# EasyEDA Pro project 单相逆变离并网和整流拓扑.eprj, schematic Schematic2
Board Name: 后级LCL滤波; Create Date: 2026-03-23; Page Name: P1; Project Name: 单相逆变离并网; Schematic Name: Schematic2; Update Date: 2026-03-25; Company: 嘉立创EDA; Page Size: A4; Version: V1.0
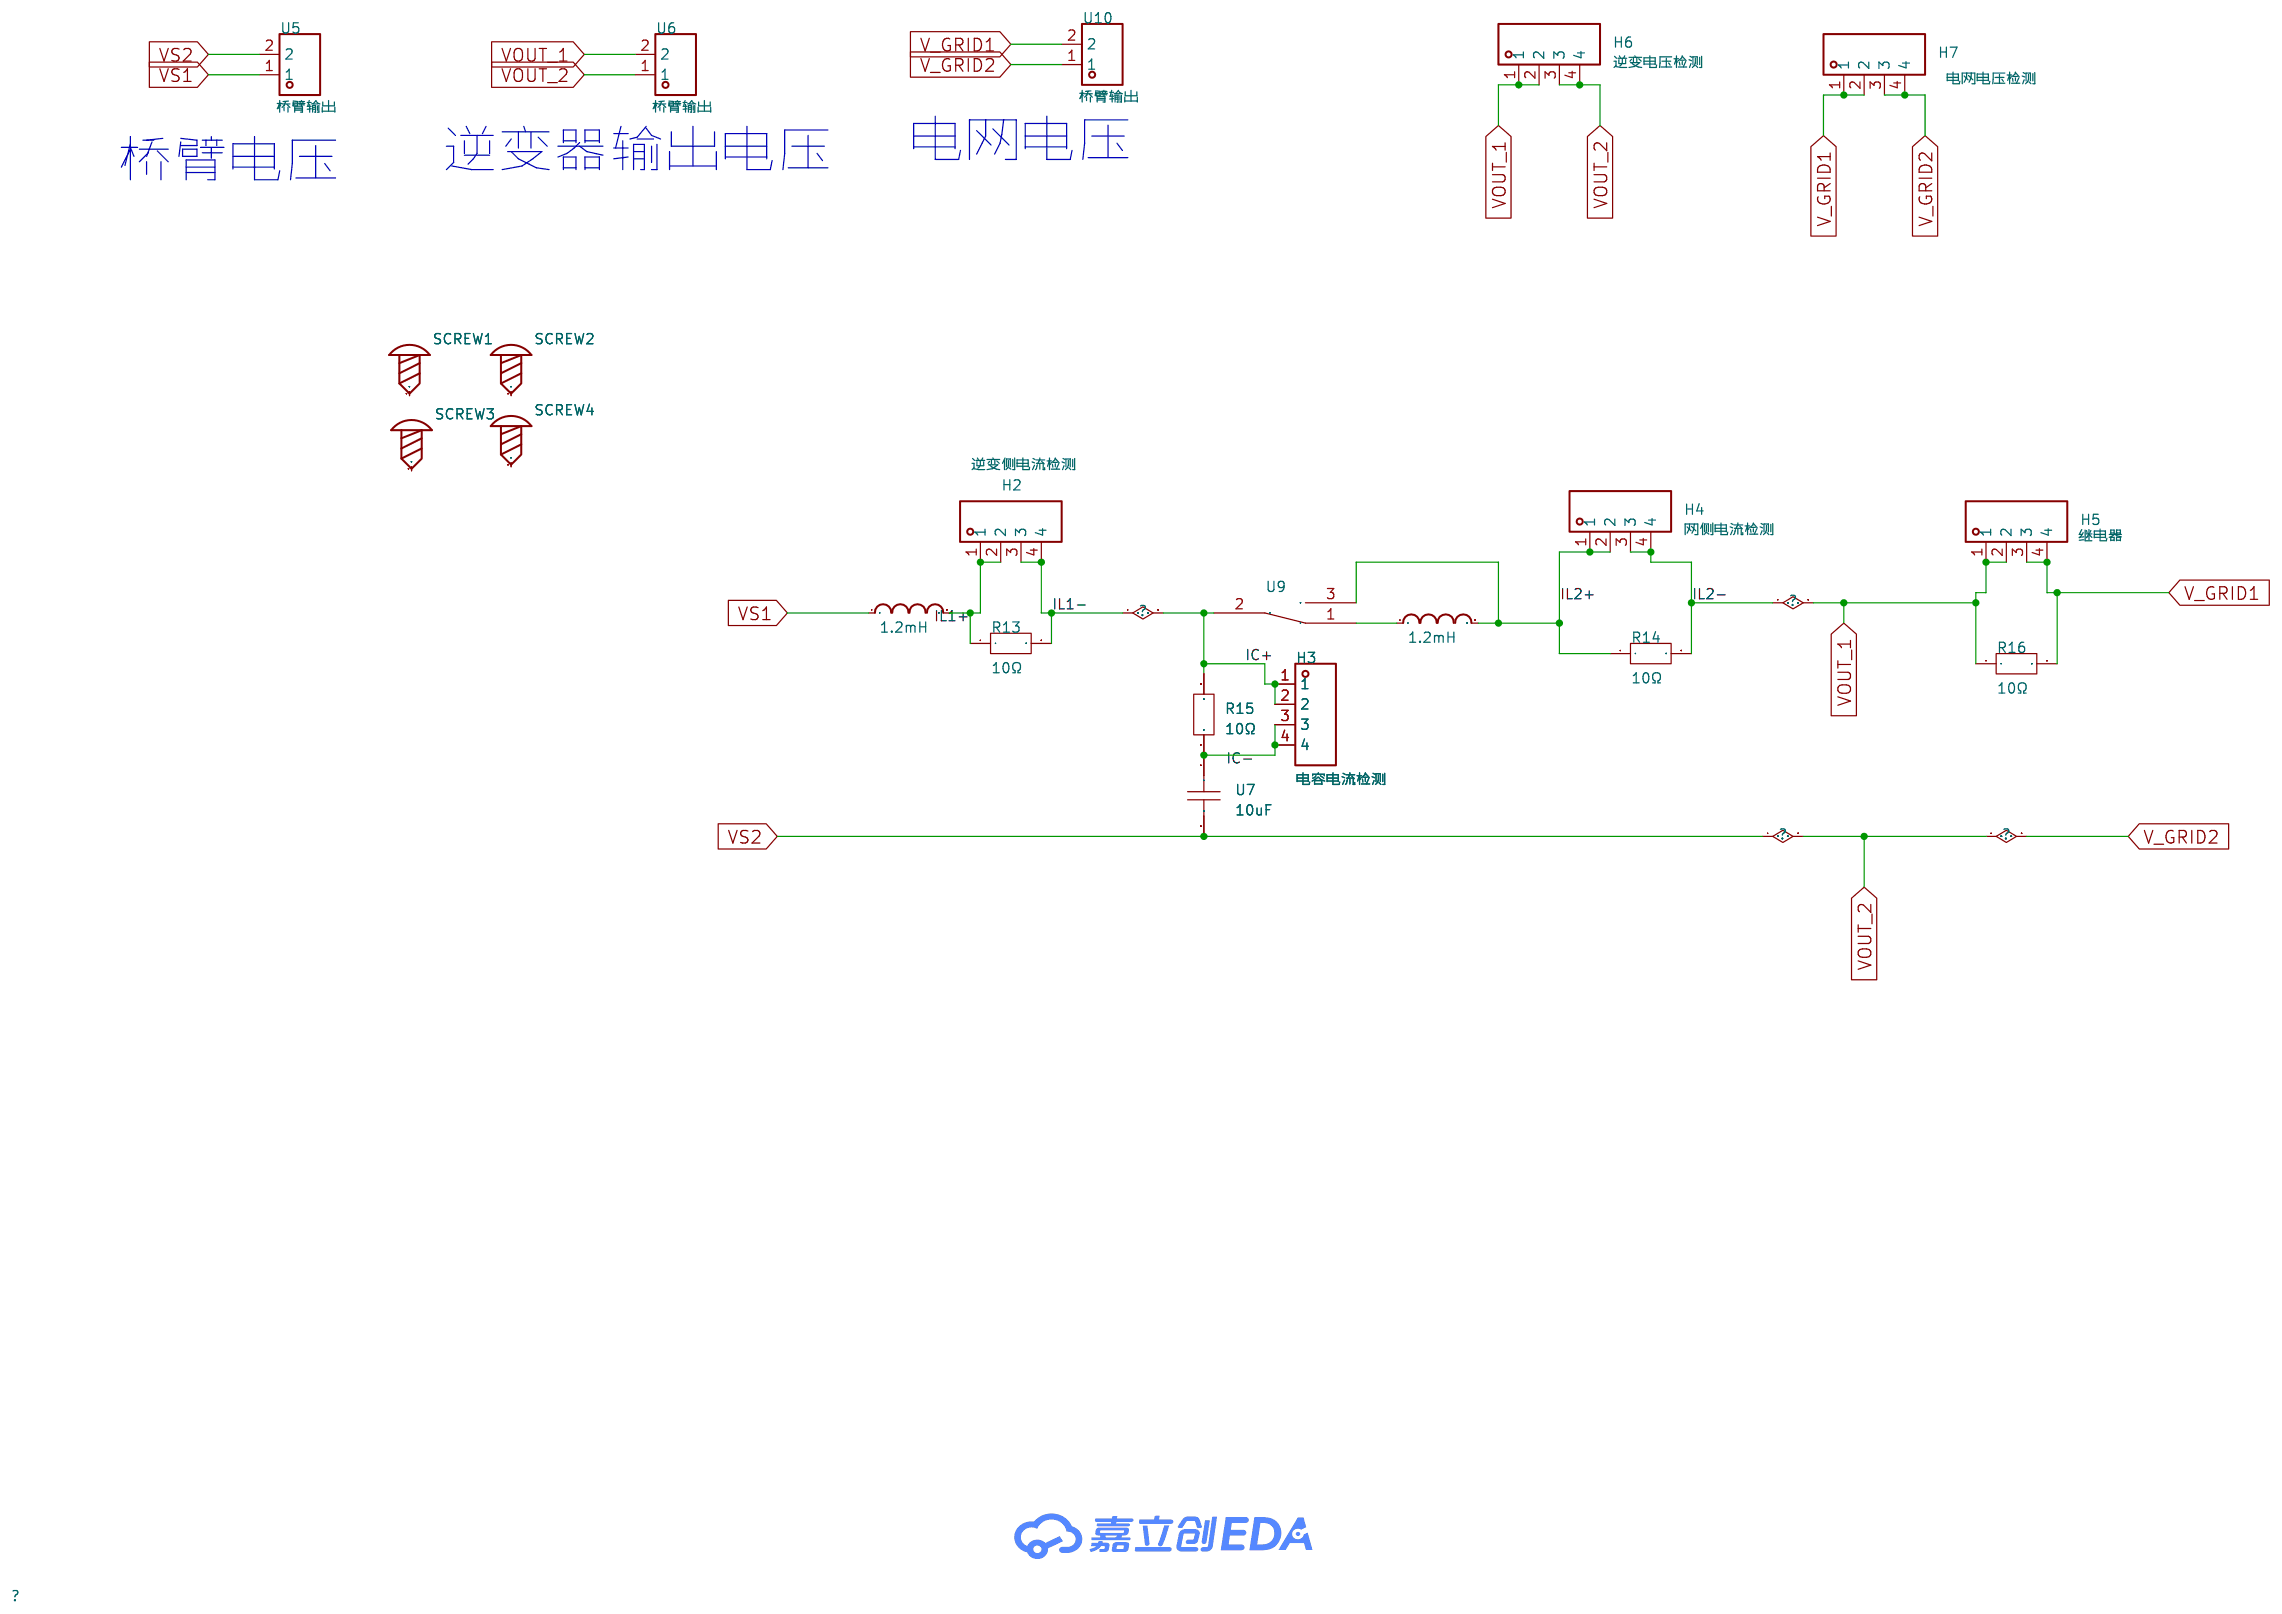
[diagram p1: schematic sheet]

## Parts
H2  逆变侧电流检测  [HDR-TH_4P-P2.54-V-F]
H3  电容电流检测  [HDR-TH_4P-P2.54-V-F]
H4  网侧电流检测  [HDR-TH_4P-P2.54-V-F]
H5  继电器  [HDR-TH_4P-P2.54-V-F]
H6  逆变电压检测  [HDR-TH_4P-P2.54-V-F]
H7  电网电压检测  [HDR-TH_4P-P2.54-V-F]
L1  1.2mH  [直插环形电感]
L2  1.2mH  [直插环形电感]
R13  10Ω  [R0603]
R14  10Ω  [R0603]
R15  10Ω  [R0603]
R16  10Ω  [R0603]
SCREW1  -  [M3螺丝]
SCREW2  -  [M3螺丝]
SCREW3  -  [M3螺丝]
SCREW4  -  [M3螺丝]
U5  桥臂输出  [CONN-TH_2P-P7.62_L15.2-W16.7-EX4.2]
U6  桥臂输出  [CONN-TH_2P-P7.62_L15.2-W16.7-EX4.2]
U7  10uF  [CAP-TH_L25.5-W13.0-P22.50-D1.4]
U9  MT-0-102-A101-M200-RS  [SW-TH_MT-0-103-A101-M200-RS]
U10  桥臂输出  [CONN-TH_2P-P7.62_L15.2-W16.7-EX4.2]

## Library data of the parts
H2-H7 = 2.54-1*4P母: 插孔结构:1x4P;间距:2.54mm;行距:-;圆孔/方孔:方孔;安装类型:直插;排数:单排;总孔位数:4P;额定电流:3A;额定电压:-;插孔方向:顶部;塑高:-;触头材质:青铜;触头镀层:-;工作温度范围:-40℃~+105℃;焊接温度(最大值):-;; LCSC Part Name: 间距:2.54mm 1x4P 直插; Supplier Part: C2718488; Manufacturer: BOOMELE(博穆精密); Supplier Footprint: 插件,P=2.54mm; Datasheet: https://atta.szlcsc.com/upload/public/pdf/source/20210301/C2718488_F4427B881E42CAA8DDB0B1C12B3A522C.pdf; Supplier: LCSC; Holes Structure: 1x4P; Pitch: 2.54mm; Circular Hole / Square Hole: 方孔; Mounting Type: 直插; Number of Rows: 单排; Number of Holes: 4P; Current Rating (Max): 3A; Holes Direction: 顶部; Contact Material: 青铜; Operating Temperature Range: -40℃~+105℃
L1 L2 = 直插环形电感
R13-R16 = RT0603DRD07110KL: 电阻类型:薄膜电阻;阻值:110kΩ;精度:±0.5%;功率:100mW;工作电压:75V;温度系数:±25ppm/℃;; LCSC Part Name: 薄膜电阻 110kΩ ±0.5% 100mW; Supplier Part: C728610; Manufacturer: YAGEO(国巨); Supplier Footprint: 0603; JLCPCB Part Class: 扩展库; Datasheet: https://item.szlcsc.com/datasheet/RT0603DRD07110KL/775925.html; Supplier: LCSC; Type: 薄膜电阻; Tolerance: ±0.5%; Power(Watts): 100mW; Voltage-Supply(Max): 75V; Temperature Coefficient: ±25ppm/℃; Operating Temperature: -55℃~+155℃
SCREW1-SCREW4 = M3螺丝: Supplier Footprint: 插件
U5 U6 U10 = DBT50G-7.62-2P-BK-P: 隔板类型:带盖板;间距:7.62mm;结构:1x2P;安装方式:直针;引脚位置:边脚;排数:1;额定电流:20A;额定电压:300V;线规 - AWG:12~22;线规 - 平方毫米:-;工作温度范围:-40℃~+105℃;颜色:黑色;每排PIN数:2;; LCSC Part Name: 7.62mm 1x2P 每排P数:2 排数:1 直针 边脚; Supplier Part: C496127; Manufacturer: DORABO(地博电气); Supplier Footprint: 插件,P=7.62mm; JLCPCB Part Class: 扩展库; Datasheet: https://atta.szlcsc.com/upload/public/pdf/source/20230321/5EF6A0D07A73B1490602C5D26A4C0507.pdf; Supplier: LCSC; Barrier Type: 带盖板; Pitch: 7.62mm; Structure: 1x2P; Mounting Style: 直针; Pin Location: 边脚; Number of Pins: 2P; Number of Rows: 1; Current Rating (Max): 20A; Voltage Rating (Max): 300V; Wire Gauge - AWG: 12~22; Operating Temperature Range: -40℃~+105℃; Color: 黑色; Number of PINs Per Row: 2
U7 = C222E106K90C000: 容值:10uF;精度:±10%;额定电压:250V;介电材料:金属化聚酯;工作温度:-55℃~+105℃;; LCSC Part Name: 10uF ±10% 250V; Supplier Part: C328801; Manufacturer: faratronic(厦门法拉); Supplier Footprint: 插件,P=22.5mm; JLCPCB Part Class: 扩展库; Datasheet: https://item.szlcsc.com/datasheet/C222E106K90C000/308648.html; Supplier: LCSC; Tolerance: ±10%; Voltage Rating: 250V; Dielectric Material: 金属化聚酯; Operating Temperature: -55℃~+105℃
U9 = MT-0-102-A101-M200-RS: 电路结构:单刀双掷;工作寿命:-;额定电流:5A;额定电压(AC):125V;安装方式:直插;; LCSC Part Name: 五件套 小型钮子三脚二档; Supplier Part: C1788492; Manufacturer: YUEN FUNG(源丰); Supplier Footprint: 插件,13x8mm; JLCPCB Part Class: 扩展库; Datasheet: https://item.szlcsc.com/datasheet/MT-0-102-A101-M200-RS/1879283.html; Supplier: LCSC; Circuit: 单刀双掷; Length: 13mm; Width: 8mm; Switch Height: 28.6mm; Current Rating: 5A; Voltage Rating (AC): 125V; Actuator Type: 圆柱钮柄; Termination Style: 焊片; Mounting Type: 直插; Operating Temperature: -25℃~+85℃

## Nets
IC+: H2.3 H2.4 H3.1 H3.2 R13.2 R15.2 U9.2
IC-: H3.3 H3.4 R15.1 U7.1
IL1+: H2.1 H2.2 L1.2 R13.1
IL2+: H4.1 H4.2 L2.2 R14.1 U9.3
IL2-: H4.3 H4.4 H5.1 H5.2 H6.1 H6.2 R14.2 R16.1 U6.2
V_GRID1: H5.3 H5.4 H7.1 H7.2 R16.2 U10.2
VOUT_2: H6.3 H6.4 H7.3 H7.4 U5.2 U6.1 U7.2 U10.1
VS1: L1.1 U5.1
$1N1843: L2.1 U9.1

Not connected (* = marked no-connect by the designer): SCREW1 1; SCREW2 1; SCREW3 1; SCREW4 1

## Notes on the sheet
- 逆变器输出电压
- 电网电压
- 桥臂电压
